# EasyEDA Pro project ProPrj_四串锂电池电源_2025-05-06.epro, schematic 原理图1

## Sheets
1 电池保护: Board Name: SC8886+BM3451; Create Date: 2025-04-15; Page Name: 电池保护; Project Name: 四串锂电池电源; Schematic Name: 原理图1; Update Date: 2025-04-16; Company: 嘉立创EDA; Page Size: A4; Version: V1.0
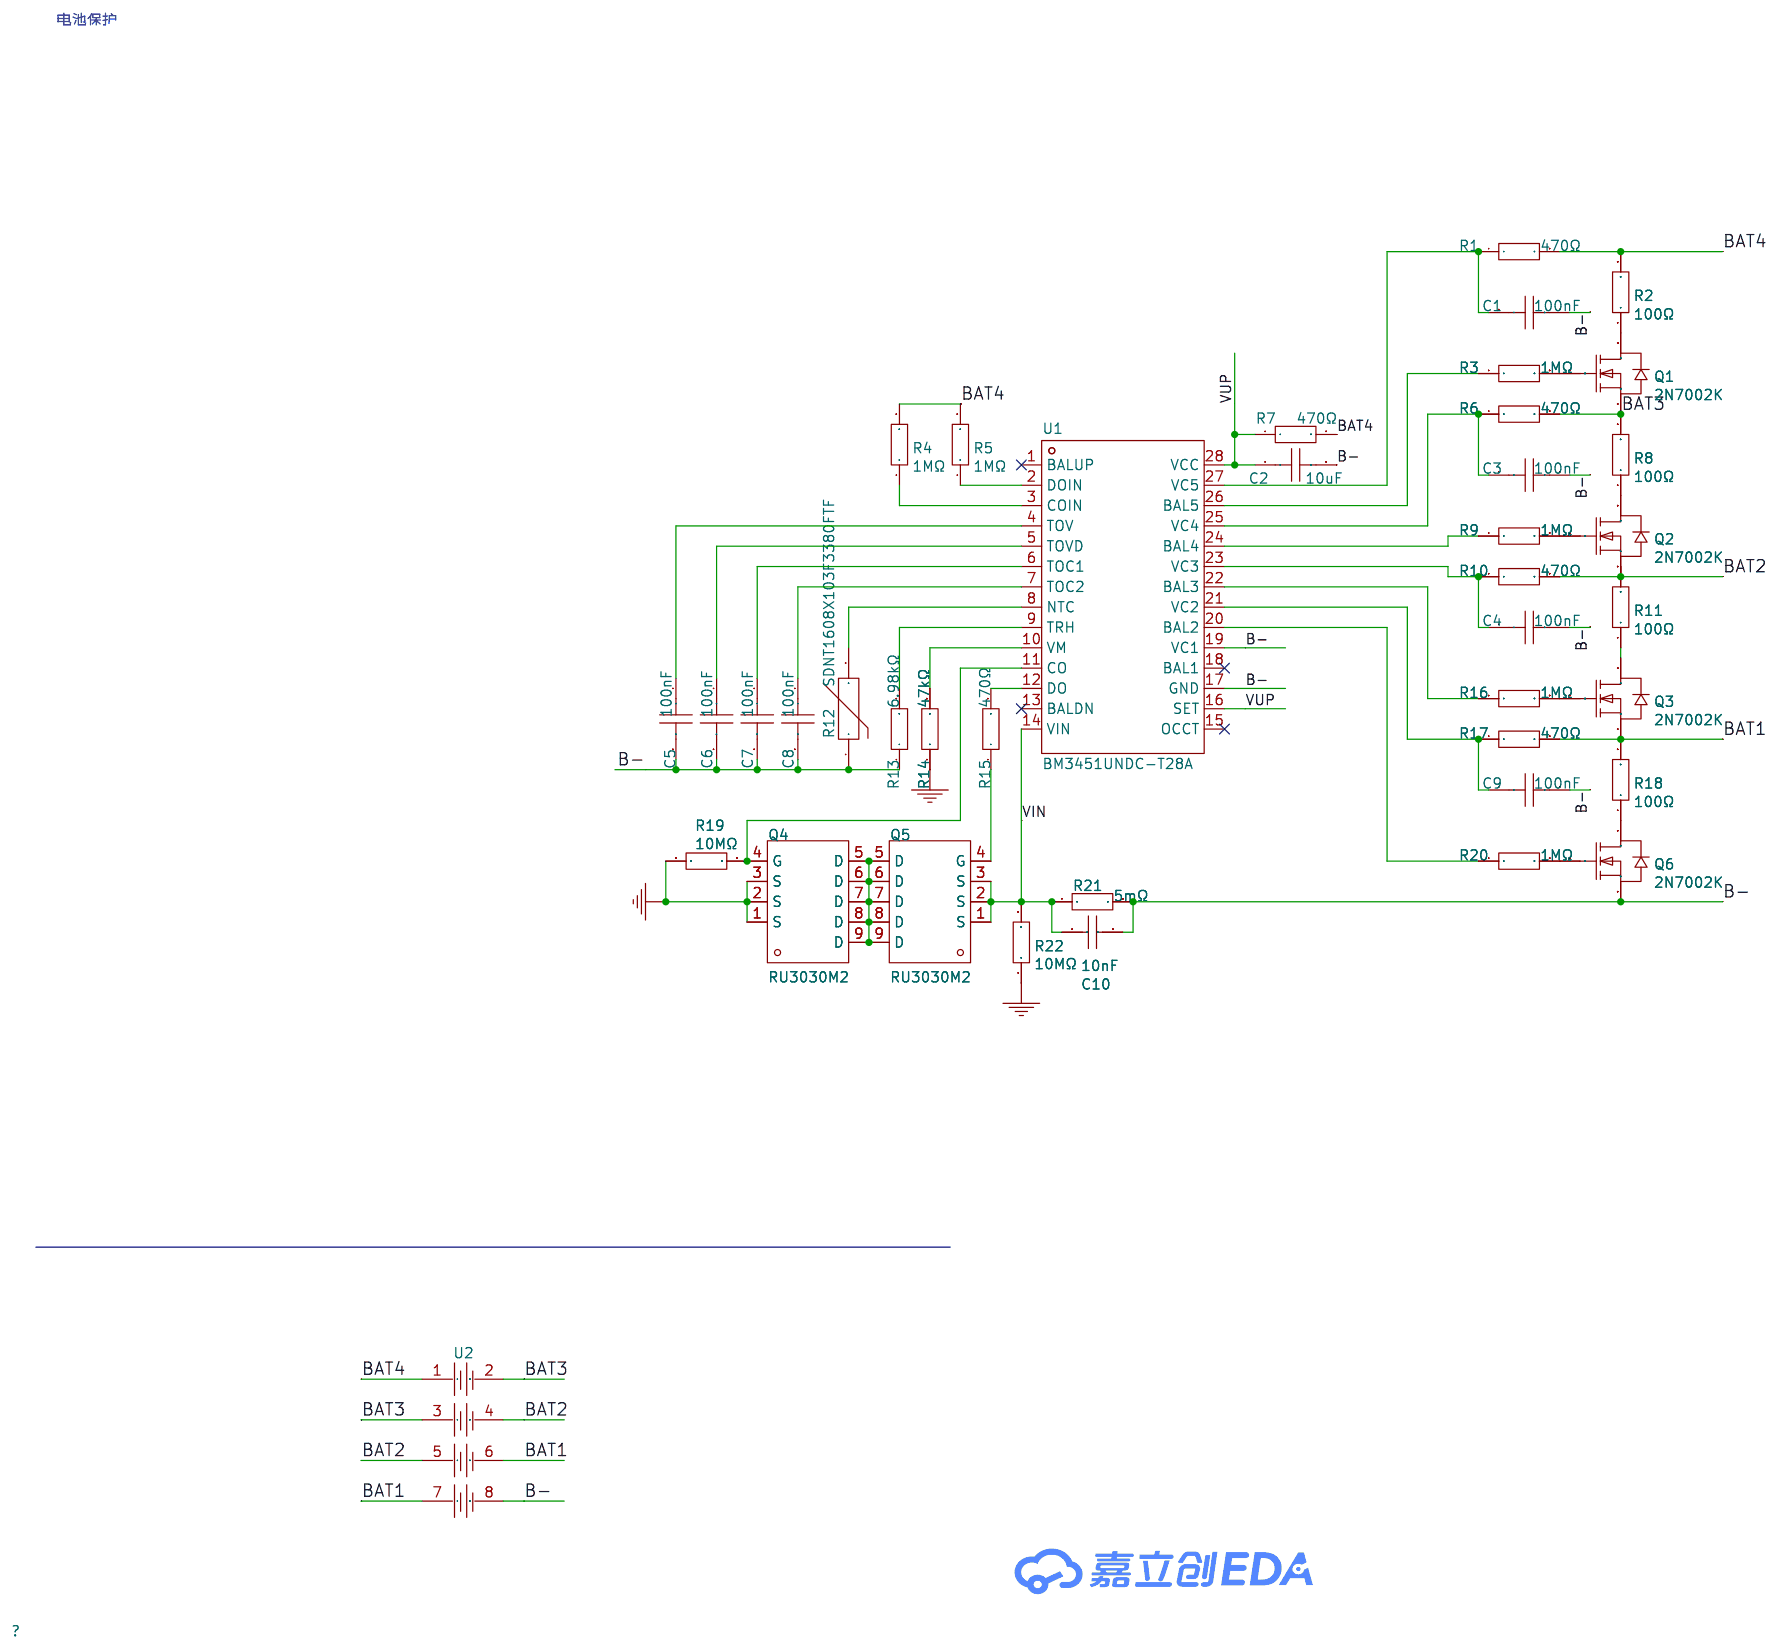
[diagram p2: 电池保护]
2 电源管理: Page Name: 电源管理; Update Date: 2025-05-01
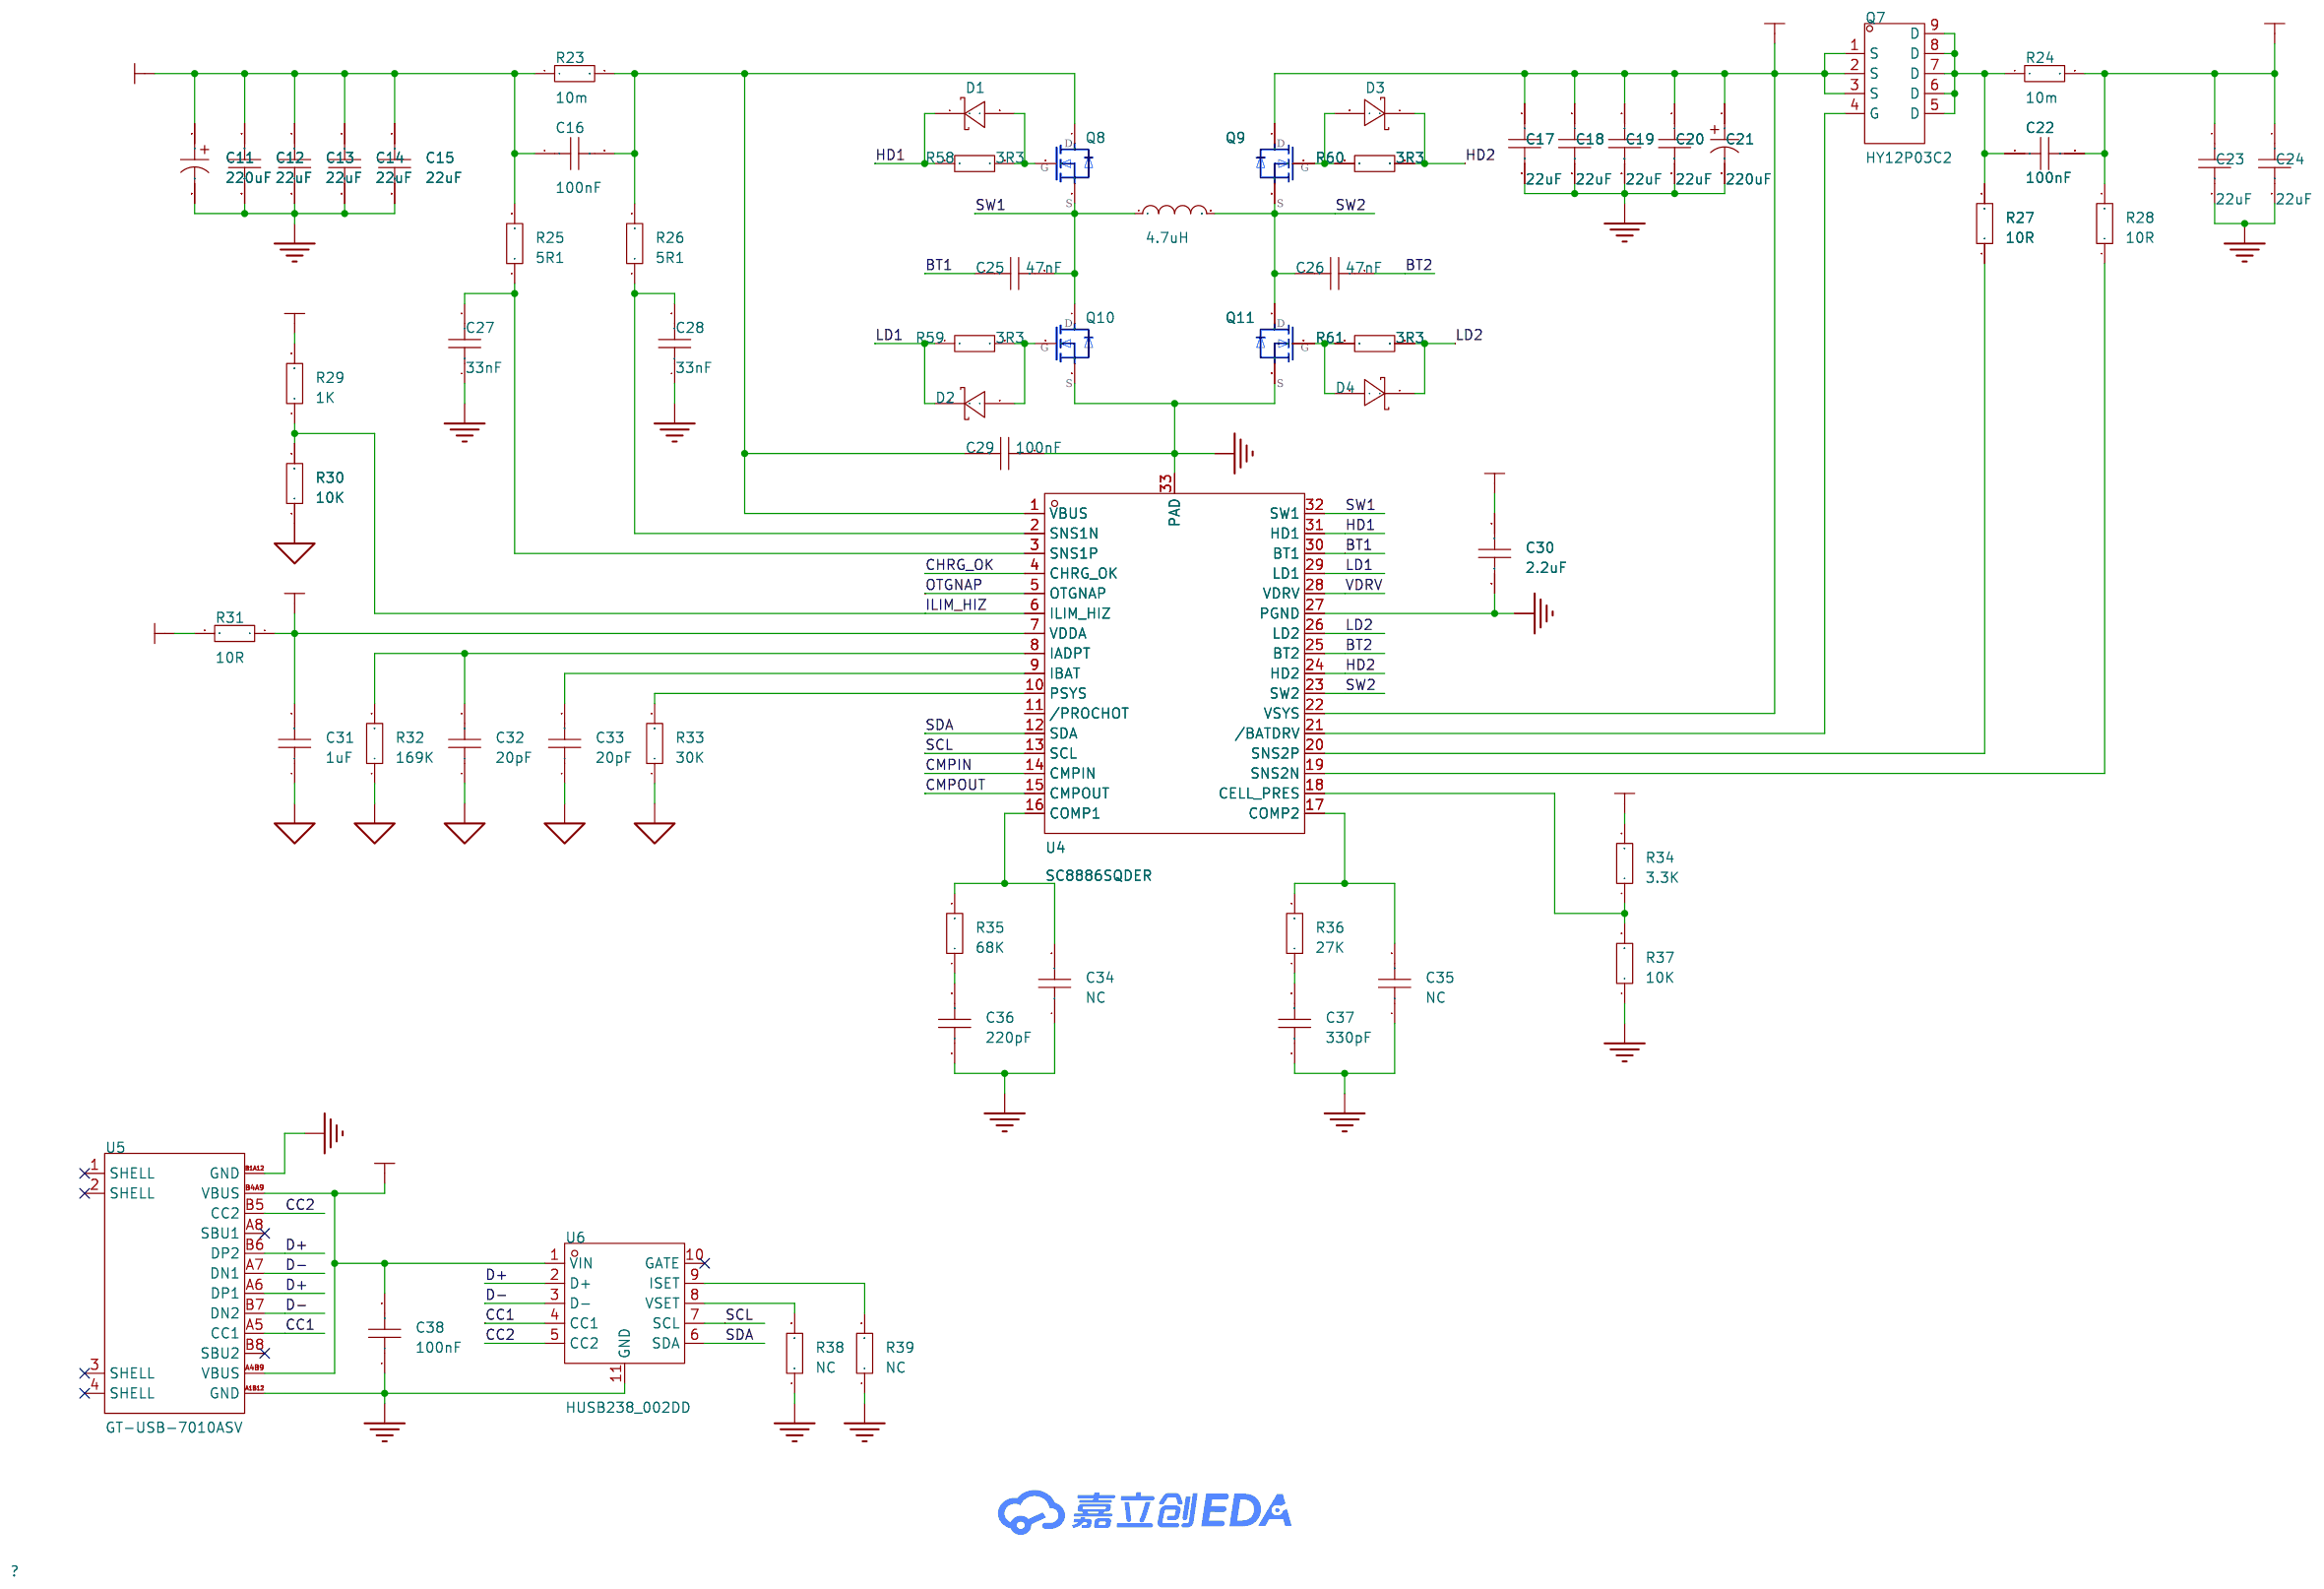
[diagram p3: 电源管理]
3 EC: Page Name: EC; Update Date: 2025-04-27
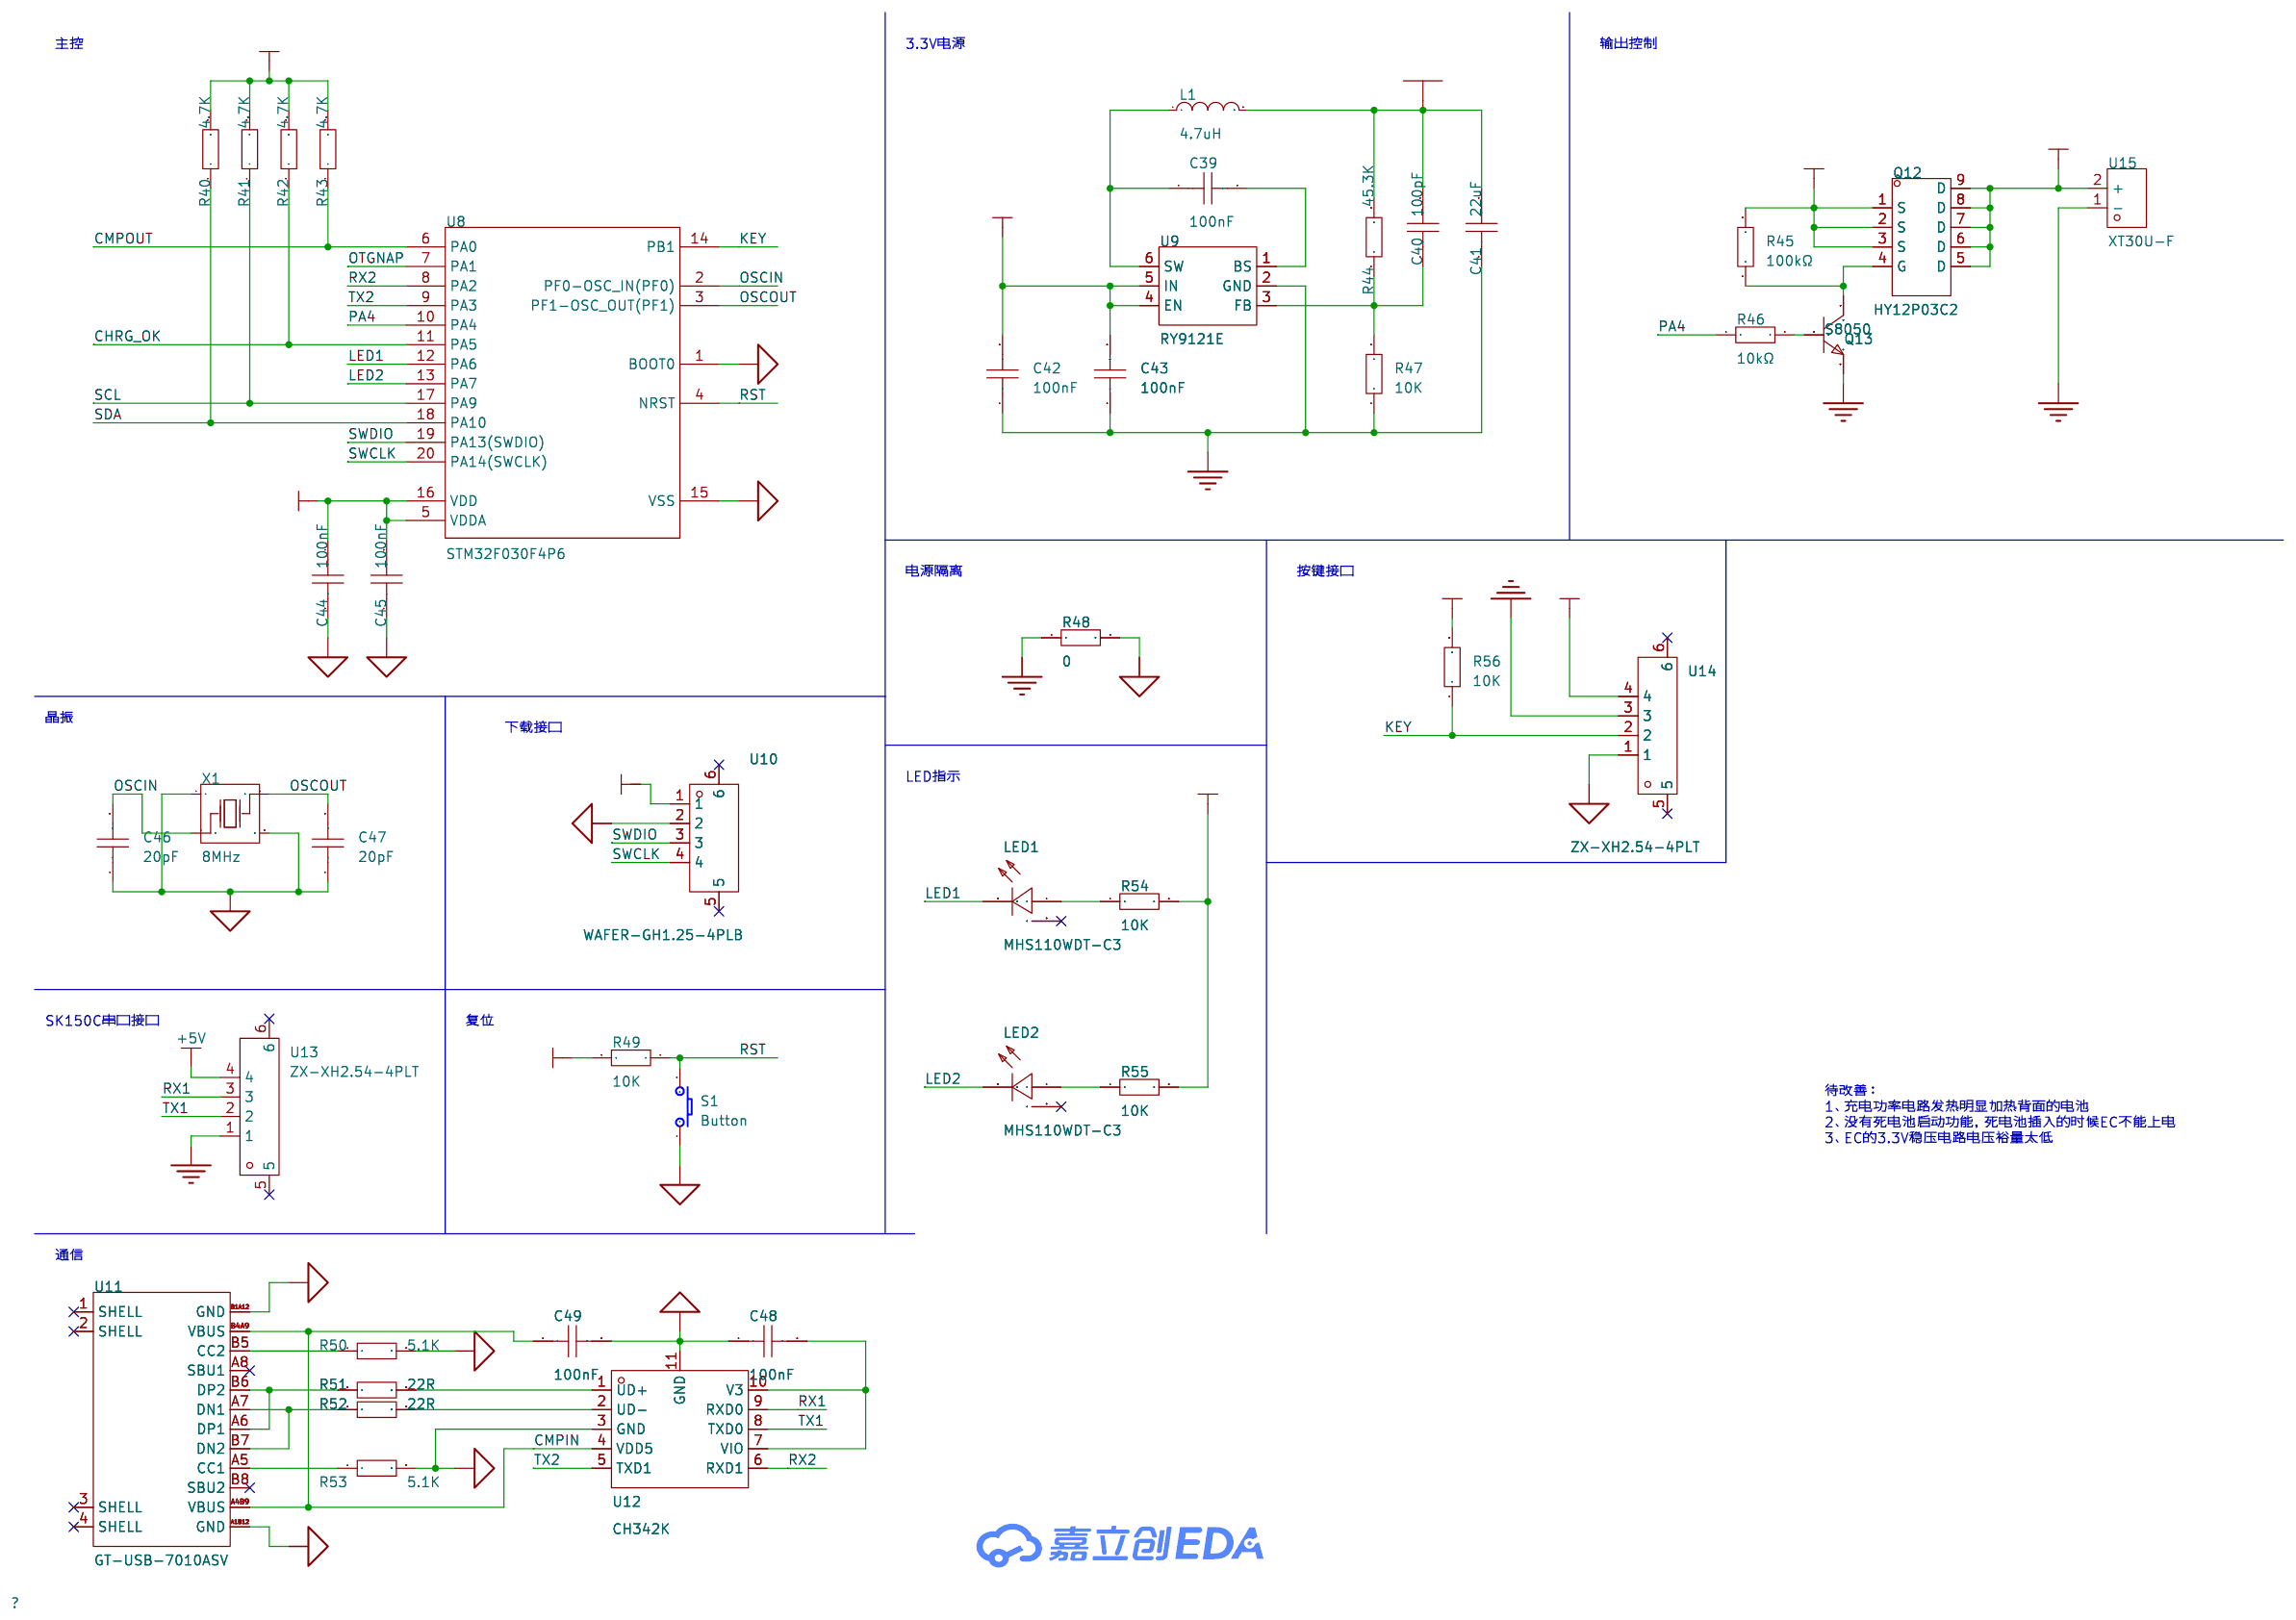
[diagram p4: EC]

## Parts
sheet EC
C39  100nF  [C0603]
C40  100pF  [C0603]
C41  22uF  [C0805]
C42  100nF  [C0805]
C43  100nF  [C0603]
C44  100nF  [C0603]
C45  100nF  [C0603]
C46  20pF  [C0603]
C47  20pF  [C0603]
C48  100nF  [C0603]
C49  100nF  [C0603]
L1  4.7uH  [IND-SMD_L2.5-W2.0_FWP252012P-2R2ML]
LED1  MHS110WDT-C3  [LED-SMD_L3.0-W1.5_MHS110WDT-C1]
LED2  MHS110WDT-C3  [LED-SMD_L3.0-W1.5_MHS110WDT-C1]
Q12  HY12P03C2  [DFN-8_L5.9-W5.2-P1.27-LS6.2-BL]
Q13  S8050  [SOT-23-3_L2.9-W1.6-P1.90-LS2.8-BR]
R40  4.7K  [R0603]
R41  4.7K  [R0603]
R42  4.7K  [R0603]
R43  4.7K  [R0603]
R44  45.3K  [R0603]
R45  100kΩ  [R0603]
R46  10kΩ  [R0603]
R47  10K  [R0603]
R48  0  [R0603]
R49  10K  [R0603]
R50  5.1K  [R0603]
R51  22R  [R0603]
R52  22R  [R0603]
R53  5.1K  [R0603]
R54  10K  [R0603]
R55  10K  [R0603]
R56  10K  [R0603]
S1  Button  [PTS810-3*4-CurvePin]
U8  STM32F030F4P6  [TSSOP-20_L6.5-W4.4-P0.65-LS6.4-BL]
U9  RY9121E  [SOT-23-6_L2.9-W1.6-P0.95-LS2.8-BL]
U10  WAFER-GH1.25-4PLB  [CONN-SMD_4P-P1.25_XUNPU_WAFER-GH1.25-4PLB]
U11  GT-USB-7010ASV  [USB-C-SMD_G-SWITCH_GT-USB-7010ASV]
U12  CH342K  [SSOP-10_L5.0-W3.9-P1.00-LS6.0-BL-EP]
U13  ZX-XH2.54-4PLT  [CONN-SMD_4P-P2.54_C9900012758]
U14  ZX-XH2.54-4PLT  [CONN-SMD_4P-P2.54_C9900012758]
U15  XT30U-F  [CONN-TH_XT30U-F]
X1  8MHz  [CRYSTAL-SMD_4P-L3.2-W2.5-BL]
sheet 电池保护
C1  100nF  [C0603]
C2  10uF  [C0603]
C3  100nF  [C0603]
C4  100nF  [C0603]
C5  100nF  [C0603]
C6  100nF  [C0603]
C7  100nF  [C0603]
C8  100nF  [C0603]
C9  100nF  [C0603]
C10  10nF  [C0603]
Q1  2N7002K  [SOT-23-3_L2.9-W1.3-P1.90-LS2.4-BL-1]
Q2  2N7002K  [SOT-23-3_L2.9-W1.3-P1.90-LS2.4-BL-1]
Q3  2N7002K  [SOT-23-3_L2.9-W1.3-P1.90-LS2.4-BL-1]
Q4  RU3030M2  [PDFN3333-8_L3.1-W3.2-P0.65-LS3.4-BL]
Q5  RU3030M2  [PDFN3333-8_L3.1-W3.2-P0.65-LS3.4-BL]
Q6  2N7002K  [SOT-23-3_L2.9-W1.3-P1.90-LS2.4-BL-1]
R1  470Ω  [R0603]
R2  100Ω  [R0603]
R3  1MΩ  [R0603]
R4  1MΩ  [R0603]
R5  1MΩ  [R0603]
R6  470Ω  [R0603]
R7  470Ω  [R0603]
R8  100Ω  [R0603]
R9  1MΩ  [R0603]
R10  470Ω  [R0603]
R11  100Ω  [R0603]
R12  SDNT1608X103F3380FTF  [R0603]
R13  6.98kΩ  [R0603]
R14  47kΩ  [R0603]
R15  470Ω  [R0603]
R16  1MΩ  [R0603]
R17  470Ω  [R0603]
R18  100Ω  [R0603]
R19  10MΩ  [R0603]
R20  1MΩ  [R0603]
R21  5mΩ  [R1206]
R22  10MΩ  [R0603]
U1  BM3451UNDC-T28A  [TSSOP-28_L9.7-W4.4-P0.65-LS6.4-BL]
U2  -  [21700四节电池仓]
sheet 电源管理
C11  220uF  [CAP-SMD_BD8.0-L8.3-W8.3-LS9.0-FD]
C12  22uF  [C0805]
C13  22uF  [C0805]
C14  22uF  [C0805]
C15  22uF  [C0805]
C16  100nF  [C0603]
C17  22uF  [C0805]
C18  22uF  [C0805]
C19  22uF  [C0805]
C20  22uF  [C0805]
C21  220uF  [CAP-SMD_BD8.0-L8.3-W8.3-LS9.0-FD]
C22  100nF  [C0603]
C23  22uF  [C0805]
C24  22uF  [C0805]
C25  47nF  [C0603]
C26  47nF  [C0603]
C27  33nF  [C0603]
C28  33nF  [C0603]
C29  100nF  [C0603]
C30  2.2uF  [C0603]
C31  1uF  [C0603]
C32  20pF  [C0603]
C33  20pF  [C0603]
C34  NC  [C0603]
C35  NC  [C0603]
C36  220pF  [C0603]
C37  330pF  [C0603]
C38  100nF  [C0603]
D1  1N5819WS  [SOD-323_L1.8-W1.3-LS2.5-RD]
D2  1N5819WS  [SOD-323_L1.8-W1.3-LS2.5-RD]
D3  1N5819WS  [SOD-323_L1.8-W1.3-LS2.5-RD]
D4  1N5819WS  [SOD-323_L1.8-W1.3-LS2.5-RD]
Q7  HY12P03C2  [DFN-8_L5.9-W5.2-P1.27-LS6.2-BL]
Q8  TPN2R703NL  [TSON3x3]
Q9  TPN2R703NL  [TSON3x3]
Q10  TPN2R703NL  [TSON3x3]
Q11  TPN2R703NL  [TSON3x3]
R23  10m  [R1206]
R24  10m  [R1206]
R25  5R1  [R0603]
R26  5R1  [R0603]
R27  10R  [R0603]
R28  10R  [R0603]
R29  1K  [R0603]
R30  10K  [R0603]
R31  10R  [R0603]
R32  169K  [R0603]
R33  30K  [R0603]
R34  3.3K  [R0603]
R35  68K  [R0603]
R36  27K  [R0603]
R37  10K  [R0603]
R38  NC  [R0603]
R39  NC  [R0603]
R58  3R3  [R0603]
R59  3R3  [R0603]
R60  3R3  [R0603]
R61  3R3  [R0603]
U3  4.7uH  [IND-SMD_L11.0-W10.0]
U4  SC8886SQDER  [QFN-32_L4.0-W4.0-P0.40-BL-EP2.8]
U5  GT-USB-7010ASV  [USB-C-SMD_G-SWITCH_GT-USB-7010ASV]
U6  HUSB238_002DD  [DFN-10_L3.0-W3.0-P0.50-BL-EP2.5]

## Library data of the parts
C16 C22 C25-C40 C43-C49 = CAP_0603: Supplier Footprint: 0603
C12-C15 C17-C20 C23 C24 C41 C42 = CAP_0805: Supplier Footprint: 0805
L1 = FWP252012P-4R7ML: 电感值:4.7uH;精度:±20%;额定电流:1.55A;饱和电流(Isat):1.9A;类型:屏蔽绕线电感;; LCSC Part Name: 4.7uH ±20% 1.9A; Supplier Part: C5179447; Manufacturer: cjiang(长江微电); Supplier Footprint: 1008; JLCPCB Part Class: 扩展库; Datasheet: https://atta.szlcsc.com/upload/public/pdf/source/20220919/3BC850B4E9B5C6895C3C658017581963.pdf; Supplier: LCSC; Tolerance: ±20%; Current Rating: 1.55A; Current - Saturation(Isat): 1.9A; DC Resistance(DCR): 196mΩ; Type: 屏蔽绕线电感
LED1 LED2 = MHS110WDT-C3: 发光颜色:白色;正向电压(VF):2.4V~3V;正向电流:5mA;透镜颜色:雾状黄透镜;发光强度:90mcd~180mcd;发光角度:130°;工作温度:-40℃~+85℃;; LCSC Part Name: 1204侧发光暖白色光; Supplier Part: C3028827; Manufacturer: MEIHUA(美华); Supplier Footprint: SMD,1.5x3mm; JLCPCB Part Class: 扩展库; Datasheet: https://atta.szlcsc.com/upload/public/pdf/source/20220606/A461A3C78FE44FF452AA3D9612F884F0.pdf; Supplier: LCSC; Emitted Color: 白色; Forward Voltage (VF): 2.4V~3V; Forward Current: 5mA; Lens Color: 雾状黄透镜; Luminous Intensity: 90mcd~180mcd; Viewing Angle: 130°; Operating Temperature: -40℃~+85℃
Q7 Q12 = HY12P03C2: 类型:1个P沟道;漏源电压(Vdss):30V;连续漏极电流(Id):50A;导通电阻(RDS(on)@Vgs,Id):14.2mΩ@4.5V,9A;功率(Pd):42W;阈值电压(Vgs(th)@Id):1V@250uA;; LCSC Part Name: 1个P沟道 耐压:30V 电流:50A; Supplier Part: C358006; Manufacturer: HUAYI(华羿微); Supplier Footprint: DFN-8(5.2x5.9); JLCPCB Part Class: 扩展库; Datasheet: https://atta.szlcsc.com/upload/public/pdf/source/20190107/C358006_05F26F72BBBFE8057F7BDEBDD3102847.pdf; Supplier: LCSC; Type: 1个P沟道; Drain Source Voltage (Vdss): 30V; Continuous Drain Current (Id): 50A; Drain Source On Resistance (RDS(on)@Vgs,Id): 14.2mΩ@4.5V,9A; Power Dissipation (Pd): 42W; Gate Threshold Voltage (Vgs(th)@Id): 1V@250uA; Total Gate Charge (Qg@Vgs): 34nC; Input Capacitance (Ciss@Vds): 2.814nF; Reverse Transfer Capacitance (Crss@Vds): 399pF; Operating Temperature: -55℃~+150℃
Q13 = S8050_C181158: 晶体管类型:NPN;集电极电流(Ic):500mA;集射极击穿电压(Vceo):25V;功率(Pd):300mW;; LCSC Part Name: NPN 电流:500mA 耐压:25V; Supplier Part: C181158; Manufacturer: Hottech(合科泰); Supplier Footprint: SOT-23; JLCPCB Part Class: Extended Part; Datasheet: https://atta.szlcsc.com/upload/public/pdf/source/20220506/D987F39D56F2975D34EC7947E75C4ABC.pdf; Supplier: LCSC; Transistor Type: NPN; Collector Current (Ic): 500mA; Collector-Emitter Breakdown Voltage (Vceo): 25V; Power Dissipation (Pd): 300mW; Transition Frequency (fT): 150MHz; Collector Cut-Off Current (Icbo): 100nA; Collector-Emitter Saturation Voltage (VCE(sat)@Ic,Ib): 600mV@500mA,50mA
R25-R44 R47-R56 R58-R61 = Res_0603: Supplier Footprint: 0603
R45 = 0603WAF1003T5E: 电阻类型:厚膜电阻;阻值:100kΩ;精度:±1%;功率:100mW;最大工作电压:75V;温度系数:±100ppm/℃;; LCSC Part Name: 100kΩ ±1% 100mW 厚膜电阻; Supplier Part: C25803; Manufacturer: UNI-ROYAL(厚声); Supplier Footprint: 0603; JLCPCB Part Class: Basic Part; Datasheet: https://atta.szlcsc.com/upload/public/pdf/source/20200306/C422600_1E6D84923E4A46A82E41ADD87F860B5C.pdf; Supplier: LCSC; Type: 厚膜电阻; Tolerance: ±1%; Power(Watts): 100mW; Overload Voltage (Max): 75V; Temperature Coefficient: ±100ppm/℃; Operating Temperature Range: -55℃~+155℃
R46 = FRC0603J103TS: 电阻类型:厚膜电阻;阻值:10kΩ;精度:±5%;功率:100mW;最大工作电压:75V;温度系数:±100ppm/℃;; LCSC Part Name: 10kΩ ±5% 100mW 厚膜电阻; Supplier Part: C2930027; Manufacturer: FOJAN(富捷); Supplier Footprint: 0603; JLCPCB Part Class: Extended Part; Datasheet: https://atta.szlcsc.com/upload/public/pdf/source/20211221/925EC7D7225764EE0046F22065062C87.pdf; Supplier: LCSC; Type: 厚膜电阻; Tolerance: ±5%; Power(Watts): 100mW; Overload Voltage (Max): 75V; Temperature Coefficient: ±100ppm/℃; Operating Temperature Range: -55℃~+155℃
S1 = KEY: Published: 24-Mar-1999; Publisher: Altium Limited; Price(RMB): 0.000; Origin Footprint 2: KEY-2-SMD-3*4; Origin Footprint 3: KEY-4-DIP-6*6; Origin Footprint 4: KEY-2-SMD-3*6-L; Origin Footprint 5: KEY-2-SMD-3*6-M; Origin Footprint 6: KEY-4-SMD-6*6; Origin Footprint 7: KEY-2-SMD-Side-3*6*3.5; Origin Footprint 8: KEY-4-SMD-12*12; Origin Footprint 9: TS-1809SM-A
U8 = STM32F030F4P6: CPU内核:ARM-M0;CPU最大主频:48MHz;应用领域:-;; LCSC Part Name: 主流ARM Cortex-M0超值系列MCU，具有16 KB Flash和48 MHz CPU; Supplier Part: C32908; Manufacturer: ST(意法半导体); Supplier Footprint: TSSOP-20; JLCPCB Part Class: 扩展库; Datasheet: https://atta.szlcsc.com/upload/public/pdf/source/20150124/1457707258011.pdf; Supplier: LCSC; CPU Core: ARM-M0; CPU Maximum Speed: 48MHz; Program Storage Size: 16KB; Program Memory Type: FLASH; Number of I/O: 15; ADC (Bit): 12bit; Low Voltage Detection Threshold: 2.4V~3.6V
U9 = RY9121E: Supplier Part: C22392164; Manufacturer: RYCHiP(蕊源); Supplier Footprint: SOT-23-6; Supplier: LCSC
U10 = WAFER-GH1.25-4PLB: 插针结构:1x4P;间距:1.25mm;安装方式:立贴;参考系列:GH;总PIN数:4P;排数:1;每排PIN数:4;行距:-;额定电流:1A;触头材质:黄铜;触头镀层:-;工作温度范围:-25℃~+85℃;; LCSC Part Name: 1x4P 间距:1.25mm 立贴 系列:GH; Supplier Part: C3029370; Manufacturer: XUNPU(讯普); Supplier Footprint: SMD,P=1.25mm; JLCPCB Part Class: 扩展库; Datasheet: https://atta.szlcsc.com/upload/public/pdf/source/20220527/44F824AAC8C2B617205E15955FF9C23D.pdf; Supplier: LCSC; Pins Structure: 1x4P; Pitch: 1.25mm; Mounting Type: 立贴; Reference Series: GH; Number of Pins: 4P; Number of Rows: 1; Number of PINs Per Row: 4; Current Rating: 1A; Contact Material: 黄铜; Operating Temperature: -25℃~+85℃; Voltage Rating: 125V; Plastic Material: LCP; Supplementary Features: 辅助焊脚; Color: 米色; Z-Height of the Board: 4.2mm; X-Length of Bottom Edge on Board (Spacing Line): 8.25mm; Y-Width of Bottom Edge on Board: 4.95mm
U5 U11 = GT-USB-7010ASV: 连接器类型:Type-C;标准:USB 2.0;公母:母;安装方式:卧贴;触点数量:16P;端口数量:1;额定电流 - 电源:3A;工作温度范围:-40℃~+85℃;; LCSC Part Name: Type-C 母 卧贴; Supplier Part: C2988369; Manufacturer: G-Switch(品赞); Supplier Footprint: SMD; Datasheet: https://atta.szlcsc.com/upload/public/pdf/source/20230327/DF227B64686AC8FA0AD1775797F2C3F1.pdf; Supplier: LCSC; Connector Type: Type-C; Standard: USB 2.0; Gender: 母; Mounting Style: 卧贴; Number of Contacts: 16P; Number of Ports: 1; Current Rating - Power (Max): 3A; Rated Voltage (Max): 24V; Connect-Disconnect Life: 1万次; Center Height: 1.68mm; Length: 7.35mm; Core Colour: 黑色; Operating Temperature Range: -40℃~+85℃
U12 = CH342K: LCSC Part Name: USB转双串口芯片; Supplier Part: C2826608; Manufacturer: WCH(南京沁恒); Supplier Footprint: ESSOP-10-150mil; JLCPCB Part Class: 扩展库; Datasheet: https://atta.szlcsc.com/upload/public/pdf/source/20211010/C2841530_D42D355CB13BEB69D3F27EE40180C477.pdf; Supplier: LCSC
U13 U14 = ZX-XH2.54-4PLT: 插针结构:1x4P;间距:2.5mm;安装方式:立贴;参考系列:XH;总PIN数:4P;排数:1;每排PIN数:4;行距:-;额定电流:-;触头材质:黄铜;触头镀层:锡;工作温度范围:-;; LCSC Part Name: 1x4P 间距:2.5mm 立贴 系列:XH; Supplier Part: C7429682; Manufacturer: Megastar(兆星); Supplier Footprint: SMD,P=2.5mm; JLCPCB Part Class: 扩展库; Datasheet: https://atta.szlcsc.com/upload/public/pdf/source/20230619/0839CF43A4681B40F50854985C226EB8.pdf; Supplier: LCSC; Pins Structure: 1x4P; Pitch: 2.5mm; Mounting Type: 立贴; Reference Series: XH; Number of Pins: 4P; Number of Rows: 1; Number of PINs Per Row: 4; Contact Material: 黄铜; Contact Plating: 锡; Supplementary Features: 辅助焊脚; Color: 米色; Z-Height of the Board: 8mm; X-Length of Bottom Edge on Board (Spacing Line): 15mm; Y-Width of Bottom Edge on Board: 8.3mm
U15 = XT30U-F: 类别:-;类型1:-;; LCSC Part Name: AMASS(艾迈斯)轻量版锂电池插头母头 XT30U-F; Supplier Part: C99102; Manufacturer: AMASS(艾迈斯); JLCPCB Part Class: 扩展库; Datasheet: https://atta.szlcsc.com/upload/public/pdf/source/20190916/C428721_B0ECB8C5937139CEFE8736D2D3175B0E.pdf; Supplier: LCSC; Brand: 艾迈斯; Type: 插头; Colour: 黄色; InterfaceType: 母头
X1 = TAXM8M4RDBCCT2T: 晶振类型:贴片晶振;频率:8MHz;常温频差:±10ppm;负载电容:10pF;频率稳定度:±15ppm;; LCSC Part Name: 8MHz ±10ppm 10pF; Supplier Part: C400090; Manufacturer: YJX(雅晶鑫); Supplier Footprint: SMD3225-4P; JLCPCB Part Class: 扩展库; Datasheet: https://atta.szlcsc.com/upload/public/pdf/source/20190626/C400090_CF95B89E745AFE4EF2E392EF8AC009D6.pdf; Supplier: LCSC; Type: 贴片晶振; Normal temperature Frequency Tolerance: ±10ppm; Load Capacitance: 10pF; Frequency Stability: ±15ppm; Equivalent Series Resistance(ESR): 250Ω; Operating Temperature: -40℃~+85℃
C1 C3-C9 = CGA0603X7R104K500JT: 容值:100nF;精度:±10%;额定电压:50V;材质(温度系数):X7R;; LCSC Part Name: 100nF ±10% 50V; Supplier Part: C6119867; Manufacturer: HRE(芯声); Supplier Footprint: 0603; JLCPCB Part Class: Extended Part; Supplier: LCSC; Tolerance: ±10%; Voltage Rated: 50V; Temperature Coefficient: X7R
C2 = CL10A106MA8NRNC: 容值:10uF;精度:±20%;额定电压:25V;材质(温度系数):X5R;; LCSC Part Name: 10uF ±20% 25V; Supplier Part: C96446; Manufacturer: SAMSUNG(三星); Supplier Footprint: 0603; JLCPCB Part Class: Basic Part; Datasheet: https://atta.szlcsc.com/upload/public/pdf/source/20160218/1457707763339.pdf; Supplier: LCSC; Tolerance: ±20%; Voltage Rated: 25V; Temperature Coefficient: X5R
C10 = CC0603KRX7R9BB103: 容值:10nF;精度:±10%;额定电压:50V;材质(温度系数):X7R;; LCSC Part Name: 10nF ±10% 50V; Supplier Part: C100042; Manufacturer: YAGEO(国巨); Supplier Footprint: 0603; JLCPCB Part Class: Extended Part; Datasheet: https://atta.szlcsc.com/upload/public/pdf/source/20181008/C309510_22F155564471FAF6A489F7D68F34234E.pdf; Supplier: LCSC; Tolerance: ±10%; Voltage Rated: 50V; Temperature Coefficient: X7R
Q1-Q3 Q6 = 2N7002K_C3008053: 类型:1个N沟道;漏源电压(Vdss):60V;连续漏极电流(Id):300mA;功率(Pd):350mW;导通电阻(RDS(on)@Vgs,Id):2.2Ω@10V,300mA;阈值电压(Vgs(th)@Id):1.6V@250uA;; LCSC Part Name: 1个N沟道 耐压:60V 电流:300mA; Supplier Part: C3008053; Manufacturer: MSKSEMI(美森科); Supplier Footprint: SOT-23; JLCPCB Part Class: Extended Part; Datasheet: https://atta.szlcsc.com/upload/public/pdf/source/20231010/5AB8D059FA255FE9F5E2F13E941A7E6F.pdf; Supplier: LCSC; Type: 1个N沟道; Drain Source Voltage (Vdss): 60V; Continuous Drain Current (Id): 300mA; Power Dissipation (Pd): 350mW; Drain Source On Resistance (RDS(on)@Vgs,Id): 2.2Ω@10V,300mA; Gate Threshold Voltage (Vgs(th)@Id): 1.6V@250uA; Total Gate Charge (Qg@Vgs): 3.7nC@10V; Input Capacitance (Ciss@Vds): 25.5pF@30V; Reverse Transfer Capacitance (Crss@Vds): 7.8pF@30V; Operating Temperature: -50℃~+150℃@(Tj)
Q4 Q5 = RU3030M2: 类型:1个N沟道;漏源电压(Vdss):30V;连续漏极电流(Id):30A;功率(Pd):29W;导通电阻(RDS(on)@Vgs,Id):15mΩ@10V,20A;阈值电压(Vgs(th)@Id):2.5V@250uA;; LCSC Part Name: 1个N沟道 耐压:30V 电流:30A; Supplier Part: C180957; Manufacturer: Ruichips(锐骏半导体); Supplier Footprint: PDFN3333-8; JLCPCB Part Class: 扩展库; Datasheet: https://atta.szlcsc.com/upload/public/pdf/source/20180301/C180957_15198944352791383984.pdf; Supplier: LCSC; Type: 1个N沟道; Drain Source Voltage (Vdss): 30V; Continuous Drain Current (Id): 30A; Power Dissipation (Pd): 29W; Drain Source On Resistance (RDS(on)@Vgs,Id): 15mΩ@10V,20A; Gate Threshold Voltage (Vgs(th)@Id): 2.5V@250uA
R1 R6 R7 R10 R15 R17 = 0603WAF4700T5E: 电阻类型:厚膜电阻;阻值:470Ω;精度:±1%;功率:100mW;最大工作电压:75V;温度系数:±100ppm/℃;; LCSC Part Name: 470Ω ±1% 100mW 厚膜电阻; Supplier Part: C23179; Manufacturer: UNI-ROYAL(厚声); Supplier Footprint: 0603; JLCPCB Part Class: Basic Part; Datasheet: https://atta.szlcsc.com/upload/public/pdf/source/20200306/C422600_1E6D84923E4A46A82E41ADD87F860B5C.pdf; Supplier: LCSC; Type: 厚膜电阻; Tolerance: ±1%; Power(Watts): 100mW; Overload Voltage (Max): 75V; Temperature Coefficient: ±100ppm/℃; Operating Temperature Range: -55℃~+155℃
R2 R8 R11 R18 = 0603WAF1000T5E: 电阻类型:厚膜电阻;阻值:100Ω;精度:±1%;功率:100mW;最大工作电压:75V;温度系数:±200ppm/℃;; LCSC Part Name: 100Ω ±1% 100mW 厚膜电阻; Supplier Part: C22775; Manufacturer: UNI-ROYAL(厚声); Supplier Footprint: 0603; JLCPCB Part Class: Basic Part; Datasheet: https://atta.szlcsc.com/upload/public/pdf/source/20200306/C422600_1E6D84923E4A46A82E41ADD87F860B5C.pdf; Supplier: LCSC; Type: 厚膜电阻; Tolerance: ±1%; Power(Watts): 100mW; Overload Voltage (Max): 75V; Temperature Coefficient: ±200ppm/℃; Operating Temperature Range: -55℃~+155℃
R3-R5 R9 R16 R20 = 0603WAF1004T5E: 电阻类型:厚膜电阻;阻值:1MΩ;精度:±1%;功率:100mW;最大工作电压:75V;温度系数:±100ppm/℃;; LCSC Part Name: 1MΩ ±1% 100mW 厚膜电阻; Supplier Part: C22935; Manufacturer: UNI-ROYAL(厚声); Supplier Footprint: 0603; JLCPCB Part Class: Basic Part; Datasheet: https://atta.szlcsc.com/upload/public/pdf/source/20200306/C422600_1E6D84923E4A46A82E41ADD87F860B5C.pdf; Supplier: LCSC; Type: 厚膜电阻; Tolerance: ±1%; Power(Watts): 100mW; Overload Voltage (Max): 75V; Temperature Coefficient: ±100ppm/℃; Operating Temperature Range: -55℃~+155℃
R12 = SDNT1608X103F3380FTF: 阻值(25℃):10kΩ;B值(25℃/50℃):3380K;电阻精度:±1%;功率:100mW;B值精度:±1%;最大稳态电流(25℃):310uA;; LCSC Part Name: 10kΩ 电阻精度:±1% 3380K; Supplier Part: C316397; Manufacturer: Sunlord(顺络); Supplier Footprint: 0603; JLCPCB Part Class: Extended Part; Datasheet: https://atta.szlcsc.com/upload/public/pdf/source/20210916/BF106A3565EDFEB141CB3E0EA3A661F8.pdf; Supplier: LCSC; Resistance @ 25℃: 10kΩ; B Constant (25℃/50℃): 3380K; Resistance Tolerance: ±1%; Power: 100mW; B Constant Tolerance: ±1%; Steady State Current (Max): 310uA; Operating Temperature: -55℃~+125℃
R13 = FRC0603F6981TS: 电阻类型:厚膜电阻;阻值:6.98kΩ;精度:±1%;功率:100mW;最大工作电压:75V;温度系数:±100ppm/℃;; LCSC Part Name: 6.98kΩ ±1% 100mW 厚膜电阻; Supplier Part: C2930122; Manufacturer: FOJAN(富捷); Supplier Footprint: 0603; JLCPCB Part Class: Extended Part; Datasheet: https://atta.szlcsc.com/upload/public/pdf/source/20211221/925EC7D7225764EE0046F22065062C87.pdf; Supplier: LCSC; Type: 厚膜电阻; Tolerance: ±1%; Power(Watts): 100mW; Overload Voltage (Max): 75V; Temperature Coefficient: ±100ppm/℃; Operating Temperature Range: -55℃~+155℃
R14 = 0603WAF4702T5E: 电阻类型:厚膜电阻;阻值:47kΩ;精度:±1%;功率:100mW;最大工作电压:75V;温度系数:±100ppm/℃;; LCSC Part Name: 47kΩ ±1% 100mW 厚膜电阻; Supplier Part: C25819; Manufacturer: UNI-ROYAL(厚声); Supplier Footprint: 0603; JLCPCB Part Class: Basic Part; Datasheet: https://atta.szlcsc.com/upload/public/pdf/source/20200306/C422600_1E6D84923E4A46A82E41ADD87F860B5C.pdf; Supplier: LCSC; Type: 厚膜电阻; Tolerance: ±1%; Power(Watts): 100mW; Overload Voltage (Max): 75V; Temperature Coefficient: ±100ppm/℃; Operating Temperature Range: -55℃~+155℃
R19 R22 = 0603WAJ0106T5E: 电阻类型:厚膜电阻;阻值:10MΩ;精度:±5%;功率:100mW;最大工作电压:75V;温度系数:±100ppm/℃;; LCSC Part Name: 10MΩ ±5% 100mW 厚膜电阻; Supplier Part: C26097; Manufacturer: UNI-ROYAL(厚声); Supplier Footprint: 0603; JLCPCB Part Class: Extended Part; Datasheet: https://atta.szlcsc.com/upload/public/pdf/source/20200306/C422600_1E6D84923E4A46A82E41ADD87F860B5C.pdf; Supplier: LCSC; Type: 厚膜电阻; Tolerance: ±5%; Power(Watts): 100mW; Overload Voltage (Max): 75V; Temperature Coefficient: ±100ppm/℃; Operating Temperature Range: -55℃~+155℃
R21 = HoLLR1206-1W-5mR-1%: 电阻类型:采样电阻;阻值:5mΩ;精度:±1%;额定压降:-;功率:1W;温度系数:±50ppm/℃;安装方式:贴片;; LCSC Part Name: 5mΩ ±1% 1W; Supplier Part: C2988648; Manufacturer: Milliohm(毫欧); Supplier Footprint: 1206; JLCPCB Part Class: Extended Part; Datasheet: https://atta.szlcsc.com/upload/public/pdf/source/20220407/F189C92CC2C10DCB4BF36375122B9E11.pdf; Supplier: LCSC; Type: 采样电阻; Tolerance: ±1%; Power(Watts): 1W; Rated Current: 31.6A; Temperature Coefficient: ±50ppm/℃; Mounting Sytle: 贴片
U1 = BM3451UNDC-T28A: Supplier Part: C94597; Supplier Footprint: TSSOP-28; JLCPCB Part Class: 扩展库; Datasheet: https://atta.szlcsc.com/upload/public/pdf/source/20170417/1492393727246.pdf; Supplier: LCSC
U2 = 四节21700电池仓
C11 C21 = MA35V220M8x8: 容值:220uF;精度:±20%;额定电压:35V;纹波电流:2.9A@100Hz;等效串联电阻(ESR):28mΩ@100kHz;类型:-;; LCSC Part Name: 220uF ±20% 35V; Supplier Part: C46550469; Manufacturer: 捷而瑞; Supplier Footprint: SMD,D8xL8mm; Datasheet: https://atta.szlcsc.com/upload/public/pdf/source/20250307/6235B7AE82D76EEDCDF841C3AB84160F.pdf; Supplier: LCSC; Tolerance: ±20%; Voltage Rating: 35V; Ripple Current: 2.9A@100Hz; Equivalent Series Resistance(ESR): 28mΩ@100kHz; Diameter: 8mm; Height - Seated (Max): 9mm; Lifetime: 2000hrs@105℃; Operating Temperature: -55℃~+105℃
D1-D4 = 1N5819WS_C191023: 正向压降(Vf):600mV@1A;直流反向耐压(Vr):40V;整流电流:1A;; LCSC Part Name: 电压:40V 电流:1A; Supplier Part: C191023; Manufacturer: Hottech(合科泰); Supplier Footprint: SOD-323; JLCPCB Part Class: 基础库; Datasheet: https://atta.szlcsc.com/upload/public/pdf/source/20220428/3CB86FD8D28D653594B4E35F9D5AEFD9.pdf; Supplier: LCSC; Forward Voltage (Vf@If): 600mV@1A; Reverse Voltage (Vr): 40V; Rectified Current: 1A
Q8-Q11 = TPN2R703NL
R23 R24 = Res_1206: Supplier Footprint: 1206
U3 = MPL-AY1050-4R7: 电感值:4.7uH;精度:-;额定电流:11.5A;饱和电流(Isat):15A;类型:-;; LCSC Part Name: 4.7uH 15A; Supplier Part: C3224636; Manufacturer: MPS(芯源); Supplier Footprint: SMD,11x10mm; JLCPCB Part Class: 扩展库; Datasheet: https://atta.szlcsc.com/upload/public/pdf/source/20240315/DD7BB26E83C39D990AA769715C67161A.pdf; Supplier: LCSC; Rated Current: 11.5A; Saturation Current (Isat): 15A; DC Resistance (DCR): 9.5mΩ
U4 = SC8886QDER: Supplier Part: C5351353; Supplier Footprint: QFN-32_4X4-EP2.8; JLCPCB Part Class: 扩展库; Supplier: LCSC
U6 = HUSB238_002DD: HUSB238是一款高度集成的USB PD受电端芯片（PD Sink，也叫PD诱骗芯片）。传输的额定功率可达100W。它兼容PD3.0 V1.3和Type-C V1.4。它还可以支持BC1.2 DCP、CDP和SDP和Apple 5V2.4A充电协议。这种方案也被称为桶形连接器替换(Barrel Connector Replacement)，旨在替代传统的桶形连接器和DC插座(DC JACK)。HUSB238已经获得USB-IF认证，TID3666。它可以用于具有传统桶形连接器或USB micro-B电源; Supplier Part: C7471904; Manufacturer: Hynetek(慧能泰); Supplier Footprint: DFN-10L(3x3); JLCPCB Part Class: 扩展库; Datasheet: https://atta.szlcsc.com/upload/public/pdf/source/20240407/14E2BCB22C39B22B34E48E1B6FC2FE3E.pdf; Supplier: LCSC

## Nets
3.3V: C40.2 C41.2 C44.1 C45.2 L1.2 R29.2 R40.2 R41.2 R42.2 R43.2 R44.2 R49.2 R54.2 R55.2 R56.2 U8.5(VDDA) U8.16(VDD) U10.1
+5V: U13.4
AGND: C31.1 C32.1 C33.1 C44.2 C45.1 C46.1 C47.1 C48.1 C49.2 R30.1 R32.1 R33.1 R48.2 R50.2 R53.2 S1.1 U8.1(BOOT0) U8.15(VSS) U10.2 U11.A1B12(GND) U11.B1A12(GND) U12.3(GND) U12.11(GND) U14.1 X1.2 X1.4
GND: C11.2 C12.2 C13.2 C14.2 C15.2 C17.2 C18.2 C19.2 C20.2 C21.2 C23.2 C24.2 C27.1 C28.1 C29.2 C30.2 C34.1 C35.1 C36.1 C37.1 C38.1 C41.1 C42.1 C43.1 Q4.1(S) Q4.2(S) Q4.3(S) Q10.3(S) Q11.3(S) Q13.2 R14.1 R19.1 R22.1 R37.1 R38.1 R39.1 R47.1 R48.1 U4.27(PGND) U4.33(PAD) U5.A1B12(GND) U5.B1A12(GND) U6.11(GND) U9.2(GND) U13.1 U14.3 U15.1(-)
VBUS: C11.1 C12.1 C13.1 C14.1 C15.1 C16.1 C38.2 R23.1 R25.2 U5.A4B9(VBUS) U5.B4A9(VBUS) U6.1(VIN)
VDDA: C31.2 R31.1 R34.2 U4.7(VDDA)
VIN: C10.1 Q5.1(S) Q5.2(S) Q5.3(S) R21.1 R22.2 U1.14(VIN)
B-: C1.2 C2.2 C3.2 C4.2 C5.2 C6.2 C7.2 C8.2 C9.2 C10.2 Q6.2(S) R12.1 R13.1 R21.2 U1.17(GND) U1.19(VC1) U2.8(2)
BAT1: Q3.2(S) R17.2 R18.2 U2.6(2) U2.7(1)
BAT2: Q2.2(S) R10.2 R11.2 U2.4(2) U2.5(1)
BAT3: Q1.2(S) R6.2 R8.2 U2.2 U2.3(1)
BAT4: C22.2 C23.1 C24.1 R1.2 R2.2 R4.2 R5.2 R7.2 R24.2 R28.2 U2.1
BT1: C25.1 U4.30(BT1)
BT2: C26.2 U4.25(BT2)
CC1: U5.A5(CC1) U6.4(CC1)
CC2: U5.B5(CC2) U6.5(CC2)
CHRG_OK: R42.1 U4.4(CHRG_OK) U8.11(PA5)
CMPIN: C49.1 U4.14(CMPIN) U11.A4B9(VBUS) U11.B4A9(VBUS) U12.4(VDD5)
CMPOUT: R43.1 U4.15(CMPOUT) U8.6(PA0)
D+: U5.A6(DP1) U5.B6(DP2) U6.2(D+)
D-: U5.A7(DN1) U5.B7(DN2) U6.3(D-)
HD1: D1.1(K) R58.1 U4.31(HD1)
HD2: D3.1(K) R60.2 U4.24(HD2)
ILIM_HIZ: R29.1 R30.2 U4.6(ILIM_HIZ)
KEY: R56.1 U8.14(PB1) U14.2
LD1: D2.1(K) R59.1 U4.29(LD1)
LD2: D4.1(K) R61.2 U4.26(LD2)
LED1: LED1.2 U8.12(PA6)
LED2: LED2.2 U8.13(PA7)
OSCIN: C46.2 U8.2(PF0-OSC_IN(PF0)) X1.1
OSCOUT: C47.2 U8.3(PF1-OSC_OUT(PF1)) X1.3
OTGNAP: U4.5(OTGNAP) U8.7(PA1)
PA4: R46.1 U8.10(PA4)
RST: R49.1 S1.2 U8.4(NRST)
RX1: U12.9(RXD0) U13.3
RX2: U8.8(PA2) U12.6(RXD1)
SCL: R41.1 U4.13(SCL) U6.7(SCL) U8.17(PA9)
SDA: R40.1 U4.12(SDA) U6.6(SDA) U8.18(PA10)
SW1: C25.2 Q8.3(S) Q10.1(D) U3.1 U4.32(SW1)
SW2: C26.1 Q9.3(S) Q11.1(D) U3.2 U4.23(SW2)
SWCLK: U8.20(PA14(SWCLK)) U10.4
SWDIO: U8.19(PA13(SWDIO)) U10.3
TX1: U12.8(TXD0) U13.2
TX2: U8.9(PA3) U12.5(TXD1)
VDRV: C30.1 R31.2 U4.28(VDRV)
VOUT: Q12.5(D) Q12.6(D) Q12.7(D) Q12.8(D) Q12.9(D) U14.4 U15.2(+)
VSYS: C17.1 C18.1 C19.1 C20.1 C21.1 C42.2 C43.2 Q7.1(S) Q7.2(S) Q7.3(S) Q9.1(D) Q12.1(S) Q12.2(S) Q12.3(S) R45.2 U4.22(VSYS) U9.4(EN) U9.5(IN)
VUP: C2.1 R7.1 U1.16(SET) U1.28(VCC)
$1N1967: C9.1 R17.1 U1.21(VC2)
$1N1968: C4.1 R10.1 U1.23(VC3)
$1N1969: C3.1 R6.1 U1.25(VC4)
$1N1970: C1.1 R1.1 U1.27(VC5)
$1N1971: R20.1 U1.20(BAL2)
$1N1972: R16.1 U1.22(BAL3)
$1N1973: R9.1 U1.24(BAL4)
$1N1974: R3.1 U1.26(BAL5)
$1N1975: R5.1 U1.2(DOIN)
$1N1976: R4.1 U1.3(COIN)
$1N1979: R15.2 U1.12(DO)
$1N1980: R14.2 U1.10(VM)
$1N1981: R13.2 U1.9(TRH)
$1N1982: R12.2 U1.8(NTC)
$1N1983: C8.1 U1.7(TOC2)
$1N1984: C7.1 U1.6(TOC1)
$1N1985: C6.1 U1.5(TOVD)
$1N1986: C5.1 U1.4(TOV)
$1N1987: Q4.5(D) Q4.6(D) Q4.7(D) Q4.8(D) Q4.9(D) Q5.5(D) Q5.6(D) Q5.7(D) Q5.8(D) Q5.9(D)
$1N1992: Q4.4(G) R19.2 U1.11(CO)
$1N1993: Q5.4(G) R15.1
$1N1994: Q6.3(D) R18.1
$1N1995: Q6.1(G) R20.2
$1N1996: Q3.3(D) R11.1
$1N1997: Q3.1(G) R16.2
$1N1998: Q2.3(D) R8.1
$1N1999: Q2.1(G) R9.2
$1N2000: Q1.3(D) R2.1
$1N2001: Q1.1(G) R3.2
$2N9896: C16.2 C29.1 Q8.1(D) R23.2 R26.2 U4.1(VBUS)
$2N9898: C27.2 R25.1 U4.3(SNS1P)
$2N9899: C28.2 R26.1 U4.2(SNS1N)
$2N9906: Q7.4(G) U4.21(/BATDRV)
$2N9908: C22.1 Q7.5(D) Q7.6(D) Q7.7(D) Q7.8(D) Q7.9(D) R24.1 R27.2
$2N10694: R27.1 U4.20(SNS2P)
$2N10699: R28.1 U4.19(SNS2N)
$2N11055: C35.2 R36.2 U4.17(COMP2)
$2N11060: C37.2 R36.1
$2N11209: C34.2 R35.2 U4.16(COMP1)
$2N11213: C36.2 R35.1
$2N11400: R34.1 R37.2 U4.18(CELL_PRES)
$2N11711: C32.2 R32.2 U4.8(IADPT)
$2N11917: C33.2 U4.9(IBAT)
$2N12015: R33.2 U4.10(PSYS)
$2N12389: R39.2 U6.9(ISET)
$2N12394: R38.2 U6.8(VSET)
$3N1326: R53.1 U11.A5(CC1)
$3N1328: R50.1 U11.B5(CC2)
$3N1407: R51.2 U12.1(UD+)
$3N1410: R51.1 U11.A6(DP1) U11.B6(DP2)
$3N1437: R52.2 U12.2(UD-)
$3N1440: R52.1 U11.A7(DN1) U11.B7(DN2)
$3N1667: C48.2 U12.7(VIO) U12.10(V3)
$3N4166: C39.1 L1.1 U9.6(SW)
$3N4191: C39.2 U9.1(BS)
$3N4511: C40.1 R44.1 R47.2 U9.3(FB)
$3N6002: Q12.4(G) Q13.3 R45.1
$3N6004: Q13.1 R46.2
$3N9179: LED1.1 R54.1
$3N9201: LED2.1 R55.1
Net-(D1-2): D1.2(A) Q8.2(G) R58.2
Net-(D2-2): D2.2(A) Q10.2(G) R59.2
Net-(D3-2): D3.2(A) Q9.2(G) R60.1
Net-(D4-2): D4.2(A) Q11.2(G) R61.1

Not connected (* = marked no-connect by the designer): LED1 3*; LED2 3*; U1 1(BALUP)* 13(BALDN)* 15(OCCT)* 18(BAL1)*; U4 11(/PROCHOT); U5 1(SHELL)* 2(SHELL)* 3(SHELL)* 4(SHELL)* A8(SBU1)* B8(SBU2)*; U6 10(GATE)*; U10 5* 6*; U11 1(SHELL)* 2(SHELL)* 3(SHELL)* 4(SHELL)* A8(SBU1)* B8(SBU2)*; U13 5* 6*; U14 5* 6*

## Notes on the sheets
sheet 1
- 电池保护
sheet 3
- 主控
- 3.3V电源
- 输出控制
- 电源隔离
- 按键接口
- 晶振
- 下载接口
- LED指示
- SK150C串口接口
- 复位
- 待改善：
  1、充电功率电路发热明显加热背面的电池
  2、没有死电池启动功能，死电池插入的时候EC不能上电
  3、EC的3.3V稳压电路电压裕量太低
- 通信
